# EAGLE design sinclair keyboard v2 (EAGLE 9.6.2)
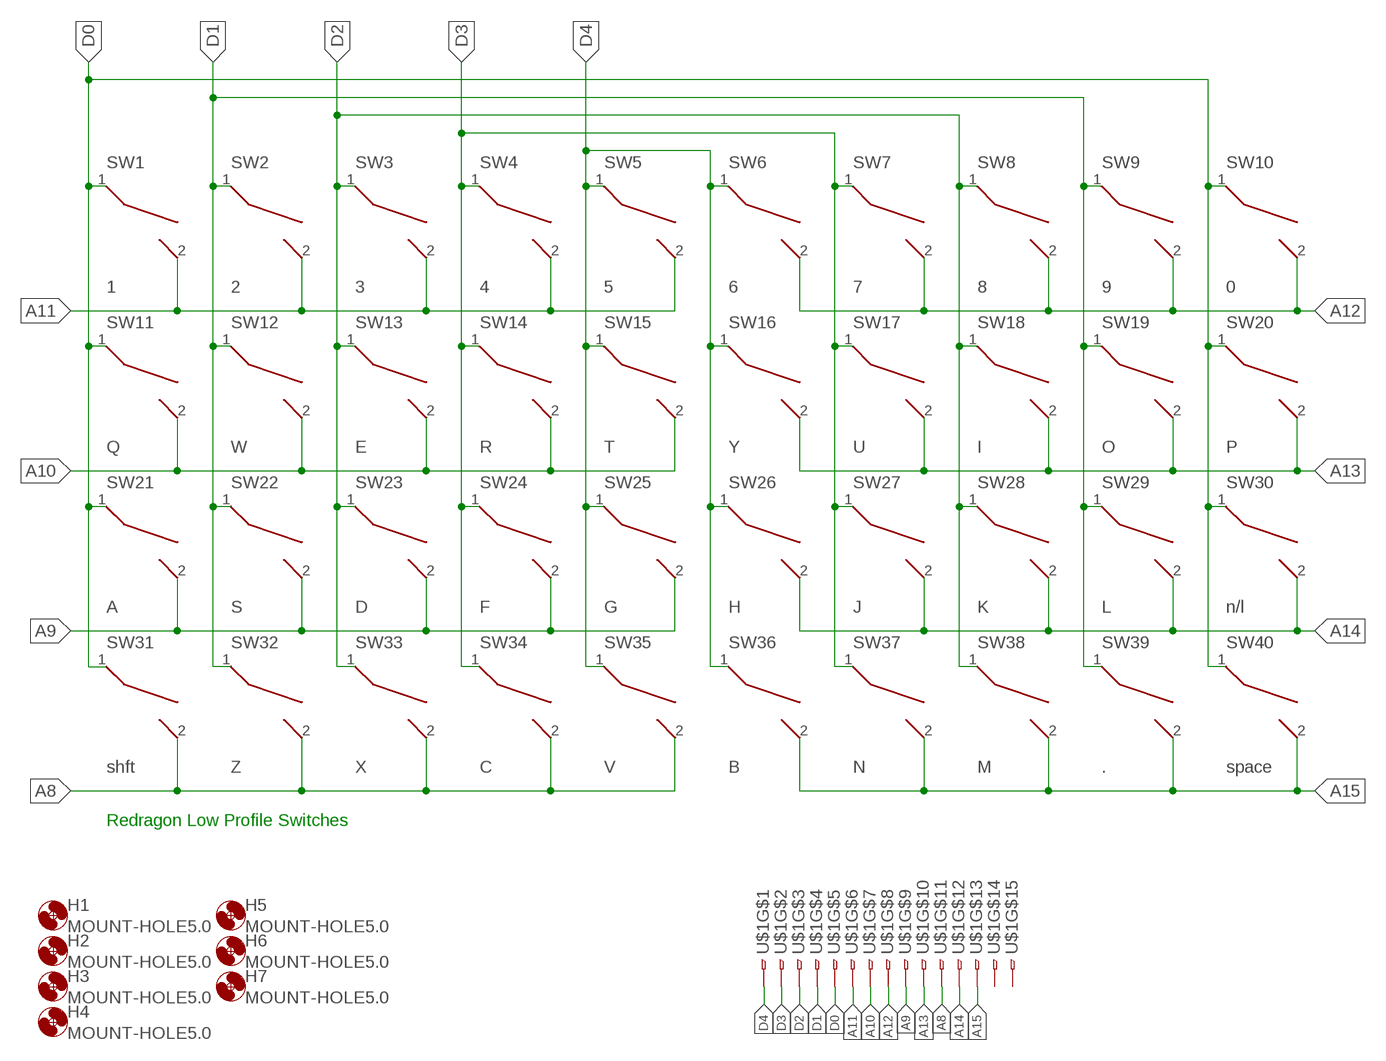
[diagram p0: schematic, sheet 1]

## Parts
H1  MOUNT-HOLE5.0  [5,0]
H2  MOUNT-HOLE5.0  [5,0]
H3  MOUNT-HOLE5.0  [5,0]
H4  MOUNT-HOLE5.0  [5,0]
H5  MOUNT-HOLE5.0  [5,0]
H6  MOUNT-HOLE5.0  [5,0]
H7  MOUNT-HOLE5.0  [5,0]
SW1  1  CHERRY_MXREDRAGON  [REDRAGON_LOWPROFILE]
SW2  2  CHERRY_MXREDRAGON  [REDRAGON_LOWPROFILE]
SW3  3  CHERRY_MXREDRAGON  [REDRAGON_LOWPROFILE]
SW4  4  CHERRY_MXREDRAGON  [REDRAGON_LOWPROFILE]
SW5  5  CHERRY_MXREDRAGON  [REDRAGON_LOWPROFILE]
SW6  6  CHERRY_MXREDRAGON  [REDRAGON_LOWPROFILE]
SW7  7  CHERRY_MXREDRAGON  [REDRAGON_LOWPROFILE]
SW8  8  CHERRY_MXREDRAGON  [REDRAGON_LOWPROFILE]
SW9  9  CHERRY_MXREDRAGON  [REDRAGON_LOWPROFILE]
SW10  0  CHERRY_MXREDRAGON  [REDRAGON_LOWPROFILE]
SW11  Q  CHERRY_MXREDRAGON  [REDRAGON_LOWPROFILE]
SW12  W  CHERRY_MXREDRAGON  [REDRAGON_LOWPROFILE]
SW13  E  CHERRY_MXREDRAGON  [REDRAGON_LOWPROFILE]
SW14  R  CHERRY_MXREDRAGON  [REDRAGON_LOWPROFILE]
SW15  T  CHERRY_MXREDRAGON  [REDRAGON_LOWPROFILE]
SW16  Y  CHERRY_MXREDRAGON  [REDRAGON_LOWPROFILE]
SW17  U  CHERRY_MXREDRAGON  [REDRAGON_LOWPROFILE]
SW18  I  CHERRY_MXREDRAGON  [REDRAGON_LOWPROFILE]
SW19  O  CHERRY_MXREDRAGON  [REDRAGON_LOWPROFILE]
SW20  P  CHERRY_MXREDRAGON  [REDRAGON_LOWPROFILE]
SW21  A  CHERRY_MXREDRAGON  [REDRAGON_LOWPROFILE]
SW22  S  CHERRY_MXREDRAGON  [REDRAGON_LOWPROFILE]
SW23  D  CHERRY_MXREDRAGON  [REDRAGON_LOWPROFILE]
SW24  F  CHERRY_MXREDRAGON  [REDRAGON_LOWPROFILE]
SW25  G  CHERRY_MXREDRAGON  [REDRAGON_LOWPROFILE]
SW26  H  CHERRY_MXREDRAGON  [REDRAGON_LOWPROFILE]
SW27  J  CHERRY_MXREDRAGON  [REDRAGON_LOWPROFILE]
SW28  K  CHERRY_MXREDRAGON  [REDRAGON_LOWPROFILE]
SW29  L  CHERRY_MXREDRAGON  [REDRAGON_LOWPROFILE]
SW30  n/l  CHERRY_MXREDRAGON  [REDRAGON_LOWPROFILE]
SW31  shft  CHERRY_MXREDRAGON  [REDRAGON_LOWPROFILE]
SW32  Z  CHERRY_MXREDRAGON  [REDRAGON_LOWPROFILE]
SW33  X  CHERRY_MXREDRAGON  [REDRAGON_LOWPROFILE]
SW34  C  CHERRY_MXREDRAGON  [REDRAGON_LOWPROFILE]
SW35  V  CHERRY_MXREDRAGON  [REDRAGON_LOWPROFILE]
SW36  B  CHERRY_MXREDRAGON  [REDRAGON_LOWPROFILE]
SW37  N  CHERRY_MXREDRAGON  [REDRAGON_LOWPROFILE]
SW38  M  CHERRY_MXREDRAGON  [REDRAGON_LOWPROFILE]
SW39  .  CHERRY_MXREDRAGON  [REDRAGON_LOWPROFILE]
SW40  space  CHERRY_MXREDRAGON  [REDRAGON_LOWPROFILE]
U$1  FH12-15S-1SH  [FH12-15S-1SH]

## Nets
A8: SW31.2 SW32.2 SW33.2 SW34.2 SW35.2 U$1.11
A9: SW21.2 SW22.2 SW23.2 SW24.2 SW25.2 U$1.9
A10: SW11.2 SW12.2 SW13.2 SW14.2 SW15.2 U$1.7
A11: SW1.2 SW2.2 SW3.2 SW4.2 SW5.2 U$1.6
A12: SW6.2 SW7.2 SW8.2 SW9.2 SW10.2 U$1.8
A13: SW16.2 SW17.2 SW18.2 SW19.2 SW20.2 U$1.10
A14: SW26.2 SW27.2 SW28.2 SW29.2 SW30.2 U$1.12
A15: SW36.2 SW37.2 SW38.2 SW39.2 SW40.2 U$1.13
D0: SW1.1 SW10.1 SW11.1 SW20.1 SW21.1 SW30.1 SW31.1 SW40.1 U$1.5
D1: SW2.1 SW9.1 SW12.1 SW19.1 SW22.1 SW29.1 SW32.1 SW39.1 U$1.4
D2: SW3.1 SW8.1 SW13.1 SW18.1 SW23.1 SW28.1 SW33.1 SW38.1 U$1.3
D3: SW4.1 SW7.1 SW14.1 SW17.1 SW24.1 SW27.1 SW34.1 SW37.1 U$1.2
D4: SW5.1 SW6.1 SW15.1 SW16.1 SW25.1 SW26.1 SW35.1 SW36.1 U$1.1
Unconnected: U$1.14 U$1.15

## Notes on the sheet
- Redragon Low Profile Switches

## Library data of the parts
H1-H7 = holes:MOUNT-HOLE: MOUNTING HOLE with drill center marker
SW1-SW40 = Cherry_MX_v7.0:CHERRY_MX
U$1 = con-hirose:FH12-15S-1SH

## Board
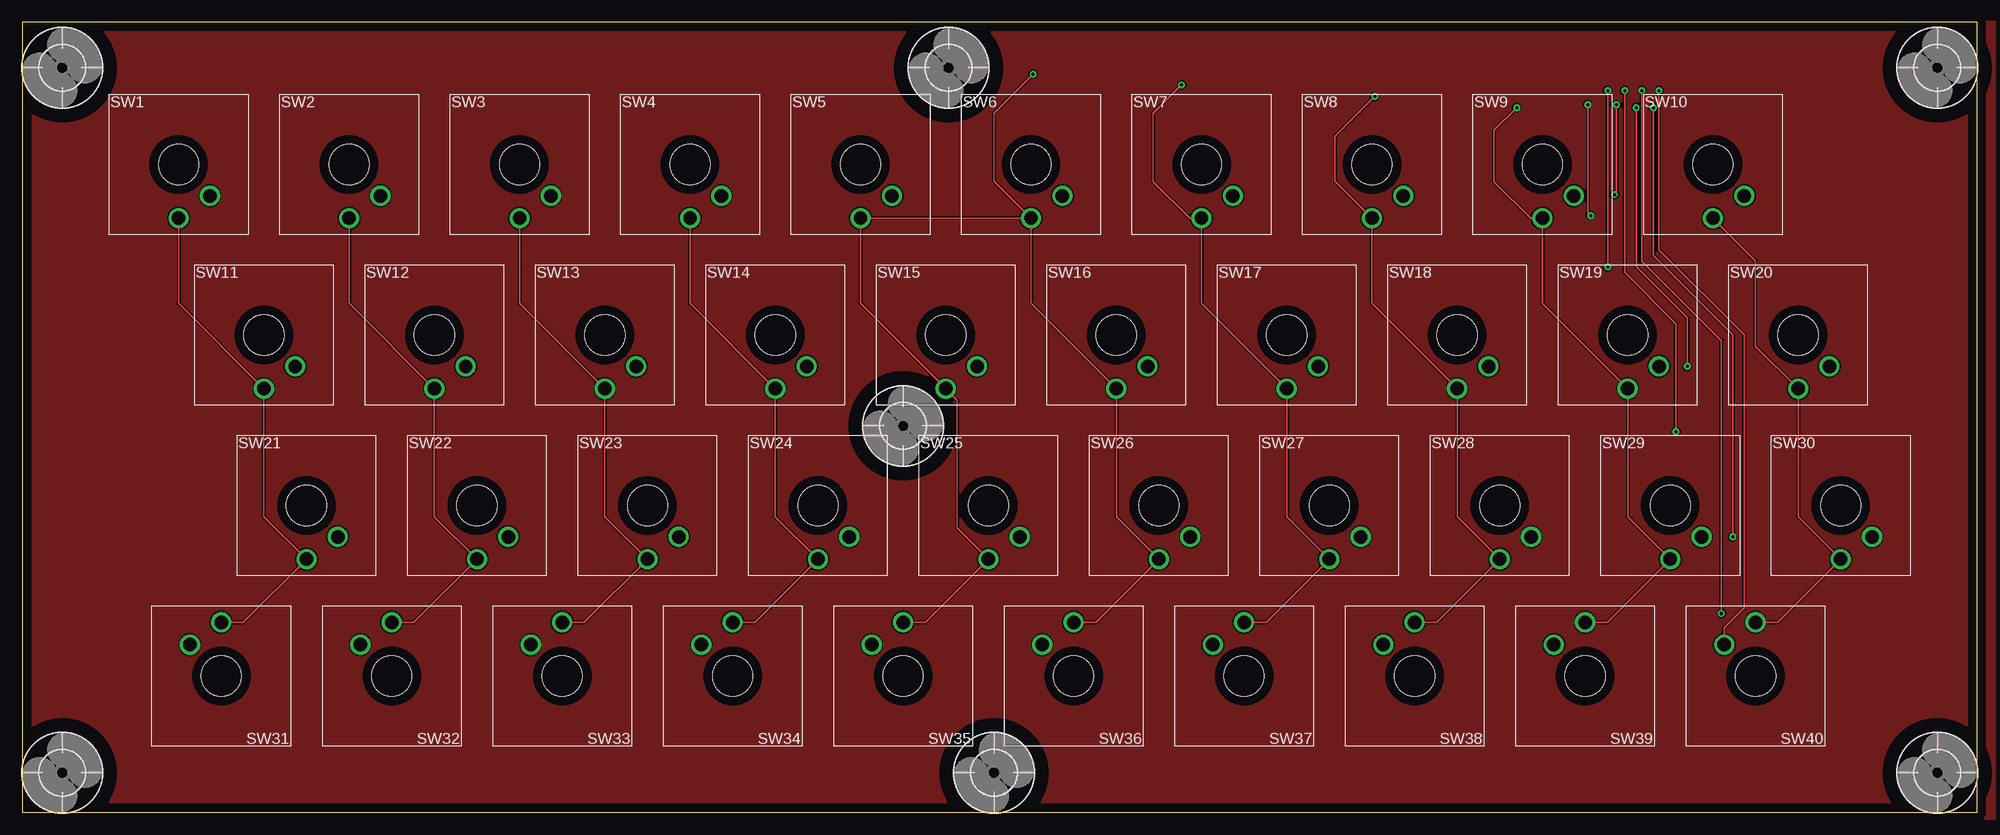
[diagram p1: board, top side]
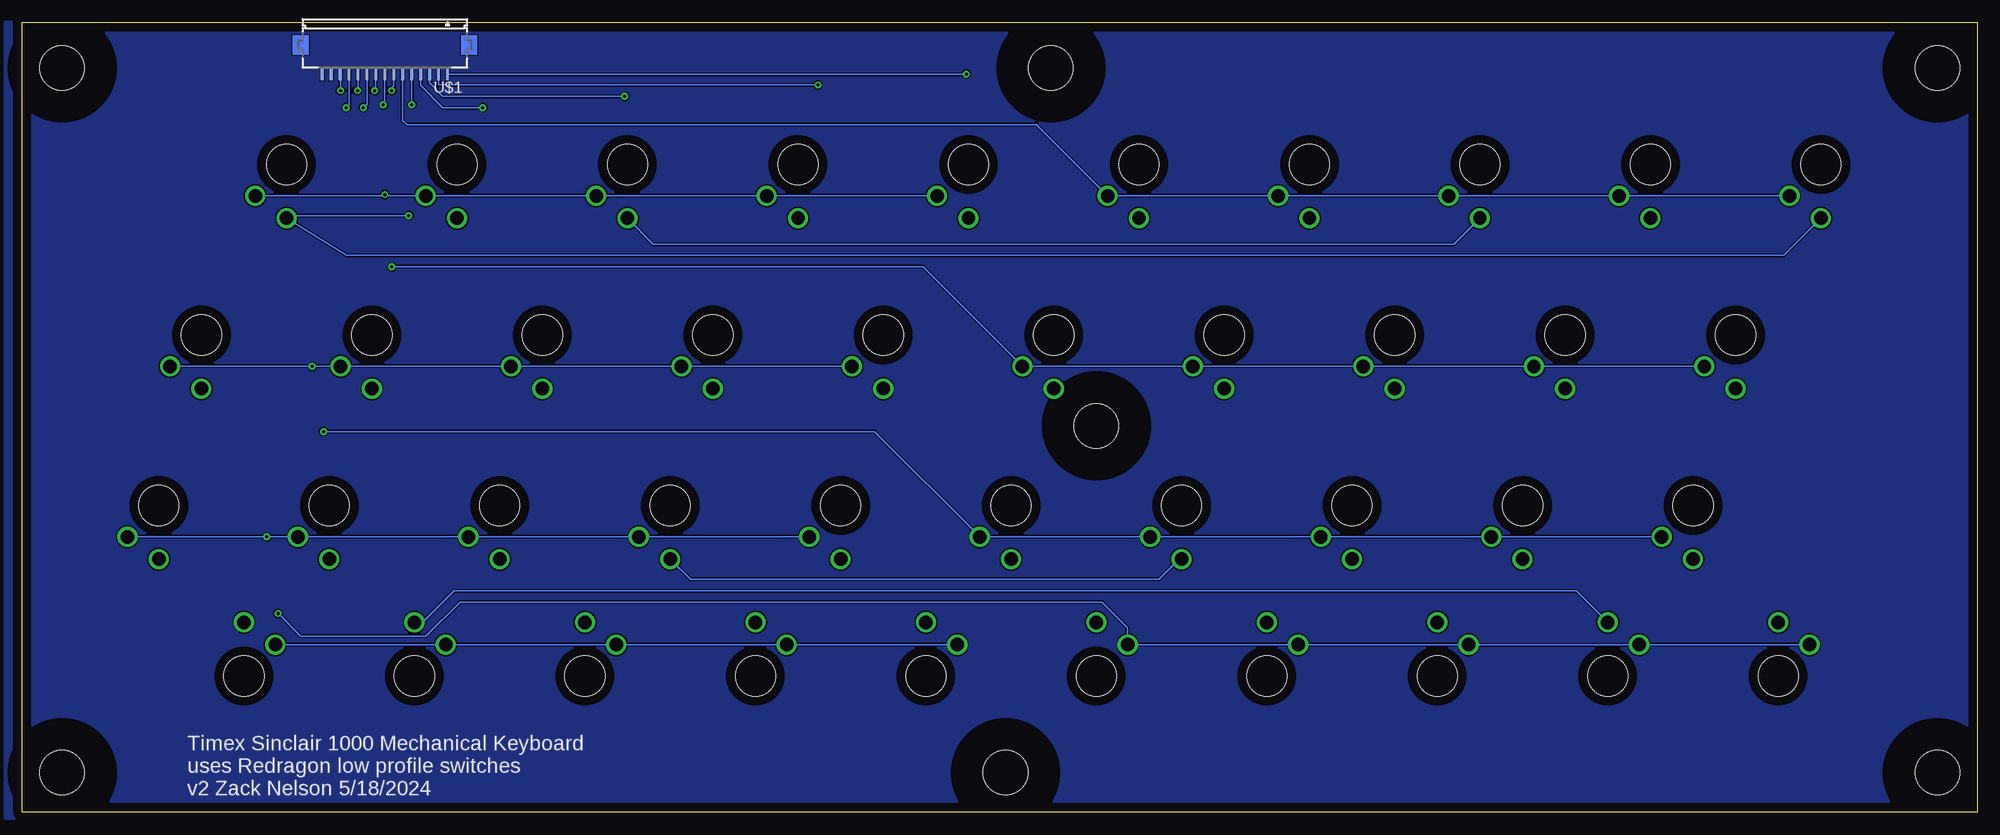
[diagram p2: board, bottom side, seen from below]

Size 218.44 x 88.27 mm. Coordinates in mm from the lower left corner, seen from the top.
Outline: 0,0 218.44,0 218.44,88.27 0,88.27 0,0
Copper layers (1*16): Top 0.035mm / dielectric 1.5mm / Bottom 0.035mm
Design rules "default": minimum track width 6mil, minimum drill 0.35mm, track to track 6mil, track to pad 6mil, pad to pad 6mil, via to via 6mil, smd to smd 6mil, copper to edge 40mil, drill to drill 6mil, minimum pad ring 10mil, minimum via ring 8mil, stop-mask expansion 4mil, vias tented up to drill 0mil, thermal gap 10mil

### Footprints (pad centres in the part's own frame; a part is rotated, then mirrored left to right if it is on the bottom)
5,0 = hole 5: 0,0
REDRAGON_LOWPROFILE = drill 1.5: 1 0,-6; 2 3.5,-3.5 | hole 4.5: 0,0
FH12-15S-1SH = smd 0.3 x 1.3: 1 -6.23,3.25; 2 -5.23,3.25; 3 -4.23,3.25; 4 -3.23,3.25; 5 -2.23,3.25; 6 -1.23,3.25; 7 -0.23,3.25; 8 0.77,3.25; 9 1.77,3.25; 10 2.77,3.25; 11 3.77,3.25; 12 4.77,3.25; 13 5.77,3.25; 14 6.77,3.25; 15 7.77,3.25

### Placement (x,y rotation side)
H1  214,4.45 0 top
H2  108.58,4.45 0 top
H3  214,83.18 0 top
H4  4.45,83.18 0 top
H5  4.45,4.45 0 top
H6  98.42,43.18 0 top
H7  103.5,83.18 0 top
SW1  17.46,72.39 0 top
SW2  36.51,72.39 0 top
SW3  55.56,72.39 0 top
SW4  74.61,72.39 0 top
SW5  93.66,72.39 0 top
SW6  112.71,72.39 0 top
SW7  131.76,72.39 0 top
SW8  150.81,72.39 0 top
SW9  169.86,72.39 0 top
SW10  188.91,72.39 0 top
SW11  26.99,53.34 0 top
SW12  46.04,53.34 0 top
SW13  65.09,53.34 0 top
SW14  84.14,53.34 0 top
SW15  103.19,53.34 0 top
SW16  122.24,53.34 0 top
SW17  141.29,53.34 0 top
SW18  160.34,53.34 0 top
SW19  179.39,53.34 0 top
SW20  198.44,53.34 0 top
SW21  31.75,34.29 0 top
SW22  50.8,34.29 0 top
SW23  69.85,34.29 0 top
SW24  88.9,34.29 0 top
SW25  107.95,34.29 0 top
SW26  127,34.29 0 top
SW27  146.05,34.29 0 top
SW28  165.1,34.29 0 top
SW29  184.15,34.29 0 top
SW30  203.2,34.29 0 top
SW31  22.22,15.24 180 top
SW32  41.27,15.24 180 top
SW33  60.33,15.24 180 top
SW34  79.38,15.24 180 top
SW35  98.42,15.24 180 top
SW36  117.47,15.24 180 top
SW37  136.53,15.24 180 top
SW38  155.58,15.24 180 top
SW39  174.62,15.24 180 top
SW40  193.68,15.24 180 top
U$1  177.17,85.72 180 bottom

### Tracks (layer width: path | path; a pad name or v marks a point on that pad's centre or on a via)
A8  (via drill 0.35)
  Top 0.152: v189.87,22.22 189.87,52.71 180.98,61.59 v180.98,80.64
  Bottom 0.152: SW31.2 SW32.2 SW33.2 SW34.2 SW35.2 94.92,20.63 97.79,23.49 169.55,23.49 173.36,19.68 187.33,19.68 v189.87,22.22 | v180.98,80.64 180.94,80.68 U$1.11
A9  (via drill 0.35)
  Top 0.152: v184.78,42.55 184.78,54.61 179.07,60.33 v179.07,80.64
  Bottom 0.152: SW21.2 SW22.2 SW23.2 SW24.2 SW25.2 123.2,42.55 v184.78,42.55 | v179.07,80.64 178.94,80.78 U$1.9
A10  (via drill 0.35)
  Top 0.152: v177.17,60.96 v177.17,80.64
  Bottom 0.152: SW11.2 SW12.2 SW13.2 SW14.2 SW15.2 117.81,60.96 v177.17,60.96 | v177.17,80.64 177.17,80.97 176.94,81.2 U$1.7
A11
  Bottom 0.152: SW1.2 SW2.2 SW3.2 SW4.2 SW5.2 105.11,76.83 175.47,76.83 175.94,77.3 U$1.6
A12  (via drill 0.35)
  Top 0.152: v178.12,79.06 178.12,69.21 v177.94,69.02
  Bottom 0.152: SW6.2 SW7.2 SW8.2 SW9.2 177.8,68.89 | 177.8,68.89 SW10.2 | v177.94,69.02 177.8,68.89 | U$1.8 177.94,79.24 v178.12,79.06
A13  (via drill 0.35)
  Top 0.152: v180.34,78.74 180.34,60.96 186.06,55.25 v186.06,49.84
  Bottom 0.152: SW16.2 SW17.2 SW18.2 SW19.2 v186.06,49.84 SW20.2 | U$1.10 179.94,79.14 v180.34,78.74
A14  (via drill 0.35)
  Top 0.152: v182.25,78.74 182.25,62.23 191.14,53.34 v191.14,30.79
  Bottom 0.152: SW26.2 SW27.2 SW28.2 SW29.2 v191.14,30.79 SW30.2 | U$1.12 181.94,79.05 v182.25,78.74
A15  (via drill 0.35)
  Top 0.152: SW40.2 190.18,20.63 192.41,22.86 192.41,53.34 182.88,62.87 v182.88,80.64
  Bottom 0.152: SW36.2 SW37.2 SW38.2 SW39.2 SW40.2 | v182.88,80.64 182.88,82.42 U$1.13
D0  (via drill 0.35)
  Top 0.152: SW1.1 17.46,56.87 SW11.1 26.99,33.05 SW21.1 24.7,21.24 SW31.1 | SW40.1 196.15,21.24 SW30.1 198.44,33.05 SW20.1 193.68,52.1 193.68,61.63 SW10.1 | v174.94,79.06 174.94,67 v175.26,66.67
  Bottom 0.152: SW10.1 188.9,66.37 | 188.9,66.37 182.21,62.23 21.62,62.23 SW1.1 | U$1.5 v174.94,79.06 | v175.26,66.67 188.59,66.67 188.9,66.37
D1  (via drill 0.35)
  Top 0.152: SW2.1 36.51,56.87 SW12.1 46.04,33.05 SW22.1 43.75,21.24 SW32.1 | SW39.1 177.1,21.24 SW29.1 179.39,33.05 SW19.1 169.86,56.87 SW9.1 168.56,66.39 164.47,70.48 164.47,76.2 v167,78.74
  Bottom 0.152: SW39.1 173.71,21.24 170.18,24.76 44.8,24.76 SW32.1 | U$1.4 173.94,81.22 171.45,78.74 v167,78.74
D2  (via drill 0.35)
  Top 0.152: SW33.1 62.8,21.24 SW23.1 65.09,33.05 SW13.1 55.56,56.87 SW3.1 | SW38.1 158.05,21.24 SW28.1 160.34,33.05 SW18.1 150.81,56.87 SW8.1 146.72,70.48 146.69,70.48 146.69,75.56 v151.13,80.01
  Bottom 0.152: SW8.1 150.81,66.36 147.96,63.5 58.45,63.5 SW3.1 | U$1.3 172.94,81.49 171.45,80.01 v151.13,80.01
D3  (via drill 0.35)
  Top 0.152: SW34.1 81.85,21.24 SW24.1 84.14,33.05 SW14.1 74.61,56.87 SW4.1 | SW37.1 139,21.24 SW27.1 141.29,33.05 SW17.1 131.76,56.87 SW7.1 130.46,66.39 126.36,70.48 126.36,78.1 v129.54,81.28
  Bottom 0.152: SW24.1 89.18,28.29 91.44,26.04 143.8,26.04 SW27.1 | U$1.2 171.94,81.28 v129.54,81.28
D4  (via drill 0.35)
  Top 0.152: SW35.1 100.9,21.24 SW25.1 104.46,31.78 104.46,46.07 SW15.1 93.66,56.87 SW5.1 SW6.1 | SW36.1 119.95,21.24 SW26.1 122.24,33.05 SW16.1 112.71,56.87 SW6.1 | v112.95,82.47 108.58,78.1 108.58,70.52 SW6.1
  Bottom 0.152: U$1.1 v112.95,82.47
GND
  pour Bottom: -0.64,-0.64 -0.64,88.27 220.34,88.27 220.34,-0.64
  pour Top: -0.64,-0.64 -0.64,88.27 220.34,88.27 220.34,-0.64

### Text on the board
bNames: Timex Sinclair 1000 Mechanical Keyboard / uses Redragon low profile switches / v2 Zack Nelson 5/18/2024